# Altium schematic sheet SENSOR.SchDoc: SENSOR
size A4; SheetNumber: 3; SheetTotal: 5
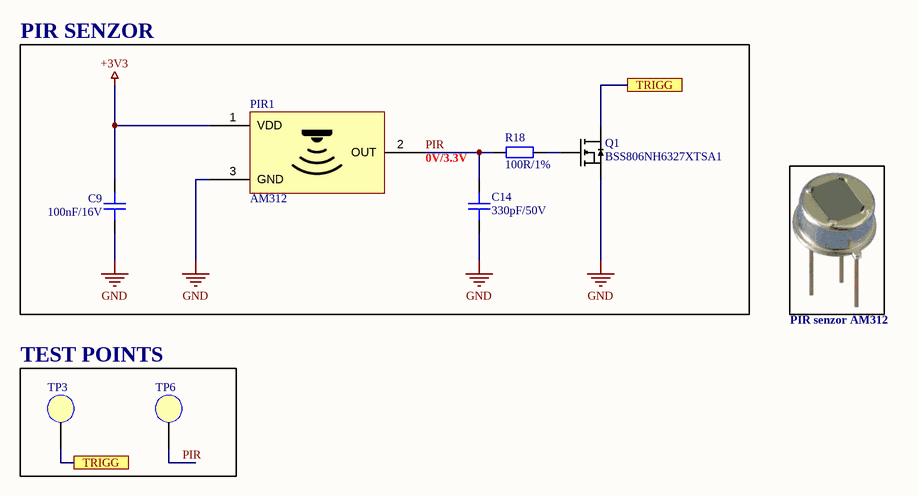
[diagram p0: SENSOR.SchDoc]

## Parts
C9  100nF/16V  [CAP_0603]
C14  330pF/50V  [CAP_0603]
PIR1  AM312  [AM312]
Q1  BSS806NH6327XTSA1  [SOT23-3]
R18  100R/1%  [RES_0603]
TP3  TESTPOINT  [TESTPOINT]  (value not drawn)
TP6  TESTPOINT  [TESTPOINT]  (value not drawn)

## Blocks framed on the sheet
PIR SENZOR: C9 C14 PIR1 Q1 R18
TEST POINTS: TP3 TP6

## Ports
TRIGG

## Nets
+3V3: C9.2 PIR1.1(VDD)
GND: C9.1 C14.1 PIR1.3(GND) Q1.2
PIR: C14.2 PIR1.2(OUT) R18.1 TP6.1(TP)
TRIGG: Q1.3 TP3.1(TP) ; port TRIGG
NetQ1_1: Q1.1 R18.2

## Notes on the sheet
- 0V/3.3V
- PIR senzor AM312
- Title
- Project
- Size
- Designed By
- Date
- Revision
- A4
- Checked By

## Library data of the parts
C9 = 100nF/16V: 0.1 µF ±10% 16V Ceramic Capacitor X7R 0603 (1608 Metric); MPN: CC0603KRX7R7BB104
C14 = 330pF/50V: 330 pF ±10% 50V Ceramic Capacitor X7R 0603 (1608 Metric); MPN: C0603C331K5RACTU
PIR1 = AM312: AM312 PIR sensor; ComponentLink1Description: MPN; ComponentLink1URL: RAK12006-0-WB-N
Q1 = BSS806NH6327XTSA1_NMOS: N-Channel 20 V 2.3A (Ta) 500mW (Ta) Surface Mount PG-SOT23; MPN: BSS806NH6327XTSA1
R18 = 100R/1%: 100 Ohms ±1% 0.1W, 1/10W Chip Resistor 0603 (1608 Metric) Automotive AEC-Q200 Thick Film; MPN: ERJ-3EKF1000V
TP3 TP6 = TESTPOINT: White PC Test Point, Miniature Phosphor Bronze Silver Plating Through Hole Mounting Type; MPN: 5002